# Altium schematic sheet Backlight Control.SchDoc
size A; SheetNumber: 7; SheetTotal: 14
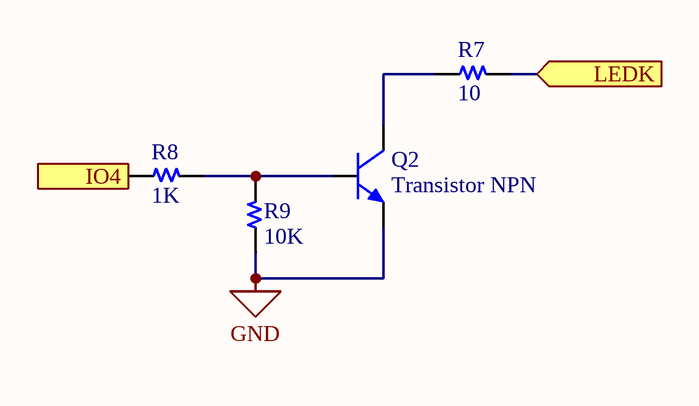
[diagram p0: Backlight Control.SchDoc]

## Parts
Q2  Transistor NPN  [SOT-23]
R7  10  [R 0805]
R8  1K  [R 0805]
R9  10K  [R 0805]

## Ports
IO4 (in, see ESP32[2B]), LEDK (in, see ESP32[2B])

## Nets
GND: Q2.2(E) R9.1
IO4: R8.1 ; port IO4
LEDK: R7.2 ; port LEDK
NetQ2_1: Q2.1(B) R8.2 R9.2
NetQ2_3: Q2.3(C) R7.1

## Library data of the parts
Q2 = Transistor NPN: NPN Bipolar Transistor
R7-R9 = Resistor